# Altium schematic sheet BLE.SchDoc
size 381 x 241 mm
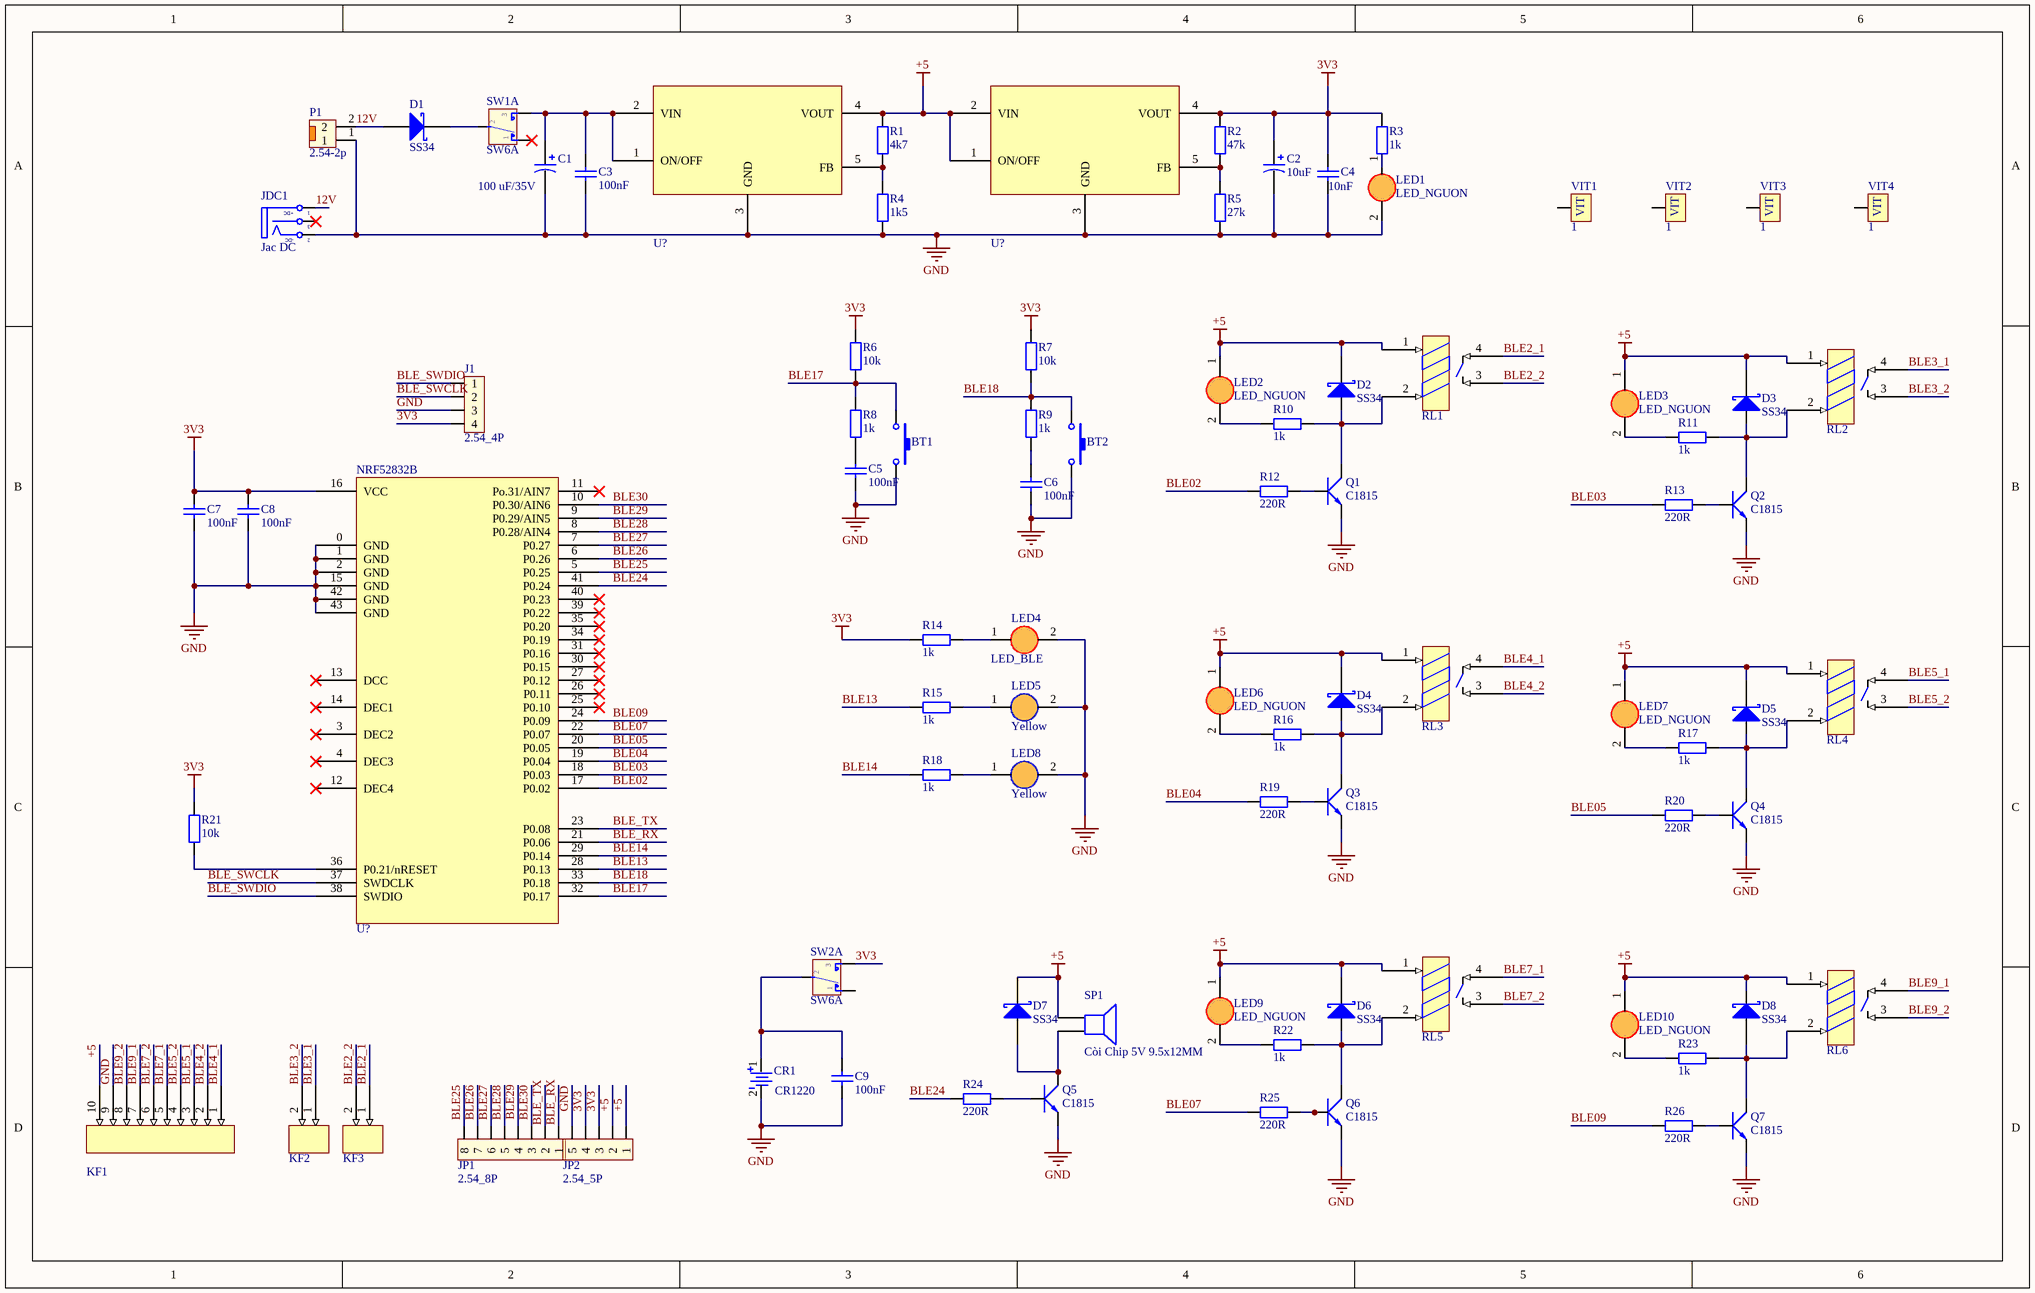
[diagram p0: BLE.SchDoc]

## Parts
BT1  Nút Nhấn 2 Chân 3x6x2.5MM SMD  [Nut Nhan 2 Chan SMD_N]  (value not drawn)
BT2  Nút Nhấn 2 Chân 3x6x2.5MM SMD  [Nut Nhan 2 Chan SMD_N]  (value not drawn)
C1  100 uF/35V  [CAP_ALUM_SMD_100102_TYPE_G]
C2  10uF  [CAP_ALUM_SMD_5054_TYPE_C]
C3  100nF  [tu 0805]
C4  10nF  [tu 0805]
C5  100nF  [tu 0805]
C6  100nF  [tu 0805]
C7  100nF  [tu 0805]
C8  100nF  [tu 0805]
C9  100nF  [tu 0805]
CR1  CR1220  [CR1220_HOLDER_SMD]
D1  SS34  [DIODE_DO214AC_SMA]
D2  SS34  [DIODE_DO214AC_SMA]
D3  SS34  [DIODE_DO214AC_SMA]
D4  SS34  [DIODE_DO214AC_SMA]
D5  SS34  [DIODE_DO214AC_SMA]
D6  SS34  [DIODE_DO214AC_SMA]
D7  SS34  [DIODE_DO214AC_SMA]
D8  SS34  [DIODE_DO214AC_SMA]
J1  2.54_4P  [jump don duc thang 2.54_4p]
JDC1  Jac DC  [DC-IN]
JP1  2.54_8P  [Jump Don Duc Thang 2.54_8p]
JP2  2.54_5P  [jump don duc 2.54_5p]
KF1  KF142R-10  [KF10]  (value not drawn)
KF2  (no value)  [KF2]
KF3  (no value)  [KF2]
LED1  LED_NGUON  [led 0805]
LED2  LED_NGUON  [led 0805]
LED3  LED_NGUON  [led 0805]
LED4  LED_BLE  [led 0805]
LED5  Yellow  [led 0805]
LED6  LED_NGUON  [led 0805]
LED7  LED_NGUON  [led 0805]
LED8  Yellow  [led 0805]
LED9  LED_NGUON  [led 0805]
LED10  LED_NGUON  [led 0805]
MIC1  U?  [Mic5V]
MIC2  U?  [Mic5V]
NRF52832  U?  [NRF52832]  (part B of 2)
P1  2.54-2p  [Header Duc Thang 2P 2.54]
Q1  C1815  [SOT23B]
Q2  C1815  [SOT23B]
Q3  C1815  [SOT23B]
Q4  C1815  [SOT23B]
Q5  C1815  [SOT23B]
Q6  C1815  [SOT23B]
Q7  C1815  [SOT23B]
R1  4k7  [tro 0805]
R2  47k  [tro 0805]
R3  1k  [tro 0805]
R4  1k5  [tro 0805]
R5  27k  [tro 0805]
R6  10k  [tro 0805]
R7  10k  [tro 0805]
R8  1k  [tro 0805]
R9  1k  [tro 0805]
R10  1k  [tro 0805]
R11  1k  [tro 0805]
R12  220R  [tro 0805]
R13  220R  [tro 0805]
R14  1k  [tro 0805]
R15  1k  [tro 0805]
R16  1k  [tro 0805]
R17  1k  [tro 0805]
R18  1k  [tro 0805]
R19  220R  [tro 0805]
R20  220R  [tro 0805]
R21  10k  [tro 0805]
R22  1k  [tro 0805]
R23  1k  [tro 0805]
R24  220R  [tro 0805]
R25  220R  [tro 0805]
R26  220R  [tro 0805]
RL1  Relay-4  [Relay-4]  (value not drawn)
RL2  Relay-4  [Relay-4]  (value not drawn)
RL3  Relay-4  [Relay-4]  (value not drawn)
RL4  Relay-4  [Relay-4]  (value not drawn)
RL5  Relay-4  [Relay-4]  (value not drawn)
RL6  Relay-4  [Relay-4]  (value not drawn)
SP1  Còi Chip 5V 9.5x12MM  [SPEAKER]
SW1  SW6A  [SW6]  (part A of 2)
SW2  SW6A  [SW6]  (part A of 2)
VIT1  1  [VIT]
VIT2  1  [VIT]
VIT3  1  [VIT]
VIT4  1  [VIT]

## Nets
3V3: C2.1 C4.1 C7.1 C8.1 J1.4 JP2.3 JP2.4 MIC2.4(VOUT) NRF52832.16(VCC) R2.1 R3.2 R6.1 R7.1 R14.2 R21.1 SW2.3
+5: D2.2(K) D3.2(K) D4.2(K) D5.2(K) D6.2(K) D7.2(K) D8.2(K) JP2.1 JP2.2 KF1.10 LED2.1(A) LED3.1(A) LED6.1(A) LED7.1(A) LED9.1(A) LED10.1(A) MIC1.4(VOUT) MIC2.1(ON/OFF) MIC2.2(VIN) R1.1 RL1.1 RL2.1 RL3.1 RL4.1 RL5.1 RL6.1 SP1.1
GND: BT1.2 BT2.2 C1.2 C2.2 C3.2 C4.2 C5.2 C6.2 C7.2 C8.2 C9.2 CR1.2(-) J1.3 JDC1.2(TN) JP2.5 KF1.9 LED1.2(K) LED4.2(K) LED5.2(K) LED8.2(K) MIC1.3(GND) MIC2.3(GND) NRF52832.0(GND) NRF52832.1(GND) NRF52832.2(GND) NRF52832.15(GND) NRF52832.42(GND) NRF52832.43(GND) P1.1 Q1.1(E) Q2.1(E) Q3.1(E) Q4.1(E) Q5.1(E) Q6.1(E) Q7.1(E) R4.2 R5.2
12V: D1.1(A) JDC1.1(T) P1.2
BLE02: NRF52832.17(P0.02) R12.2
BLE2_1: KF3.1 RL1.4
BLE2_2: KF3.2 RL1.3
BLE03: NRF52832.18(P0.03) R13.2
BLE3_1: KF2.1 RL2.4
BLE3_2: KF2.2 RL2.3
BLE04: NRF52832.19(P0.04) R19.2
BLE4_1: KF1.1 RL3.4
BLE4_2: KF1.2 RL3.3
BLE05: NRF52832.20(P0.05) R20.2
BLE5_1: KF1.3 RL4.4
BLE5_2: KF1.4 RL4.3
BLE07: NRF52832.22(P0.07) R25.2
BLE7_1: KF1.5 RL5.4
BLE7_2: KF1.6 RL5.3
BLE09: NRF52832.24(P0.09) R26.2
BLE9_1: KF1.7 RL6.4
BLE9_2: KF1.8 RL6.3
BLE13: NRF52832.28(P0.13) R15.2
BLE14: NRF52832.29(P0.14) R18.2
BLE17: BT1.1 NRF52832.32(P0.17) R6.2 R8.2
BLE18: BT2.1 NRF52832.33(P0.18) R7.2 R9.2
BLE24: NRF52832.41(P0.24) R24.2
BLE25: JP1.8 NRF52832.5(P0.25)
BLE26: JP1.7 NRF52832.6(P0.26)
BLE27: JP1.6 NRF52832.7(P0.27)
BLE28: JP1.5 NRF52832.8(P0.28/AIN4)
BLE29: JP1.4 NRF52832.9(P0.29/AIN5)
BLE30: JP1.3 NRF52832.10(P0.30/AIN6)
BLE_RX: JP1.1 NRF52832.21(P0.06)
BLE_SWCLK: J1.2 NRF52832.37(SWDCLK)
BLE_SWDIO: J1.1 NRF52832.38(SWDIO)
BLE_TX: JP1.2 NRF52832.23(P0.08)
NetC1_1: C1.1 C3.1 MIC1.1(ON/OFF) MIC1.2(VIN) SW1.3
NetC5_1: C5.1 R8.1
NetC6_1: C6.1 R9.1
NetC9_1: C9.1 CR1.1(+) SW2.2
NetD1_2: D1.2(K) SW1.2
NetD2_1: D2.1(A) Q1.2(C) R10.1 RL1.2
NetD3_1: D3.1(A) Q2.2(C) R11.1 RL2.2
NetD4_1: D4.1(A) Q3.2(C) R16.1 RL3.2
NetD5_1: D5.1(A) Q4.2(C) R17.1 RL4.2
NetD6_1: D6.1(A) Q6.2(C) R22.1 RL5.2
NetD7_1: D7.1(A) Q5.2(C) SP1.2
NetD8_1: D8.1(A) Q7.2(C) R23.1 RL6.2
NetLED1_1: LED1.1(A) R3.1
NetLED2_2: LED2.2(K) R10.2
NetLED3_2: LED3.2(K) R11.2
NetLED4_1: LED4.1(A) R14.1
NetLED5_1: LED5.1(A) R15.1
NetLED6_2: LED6.2(K) R16.2
NetLED7_2: LED7.2(K) R17.2
NetLED8_1: LED8.1(A) R18.1
NetLED9_2: LED9.2(K) R22.2
NetLED10_2: LED10.2(K) R23.2
NetMIC1_5: MIC1.5(FB) R1.2 R4.1
NetMIC2_5: MIC2.5(FB) R2.2 R5.1
NetNRF52832_36: NRF52832.36(P0.21/nRESET) R21.2
NetQ1_3: Q1.3(B) R12.1
NetQ2_3: Q2.3(B) R13.1
NetQ3_3: Q3.3(B) R19.1
NetQ4_3: Q4.3(B) R20.1
NetQ5_3: Q5.3(B) R24.1
NetQ6_3: Q6.3(B) R25.1
NetQ7_3: Q7.3(B) R26.1

Not connected (* = marked no-connect by the designer): JDC1 3(S)*; NRF52832 3(DEC2)* 4(DEC3)* 11(Po.31/AIN7)* 12(DEC4)* 13(DCC)* 14(DEC1)* 25(P0.10)* 26(P0.11)* 27(P0.12)* 30(P0.15)* 31(P0.16)* 34(P0.19)* 35(P0.20)* 39(P0.22)* 40(P0.23)*; SW1 1*; SW2 1; VIT1 VIT1(1); VIT2 VIT1(1); VIT3 VIT1(1); VIT4 VIT1(1)

## Notes on the sheet
- (in symbol DCIN) +DC; -DC

## Library data of the parts
BT1 BT2 = Nut Nhan 2 Chan SMD: Dán; Don_Vi: Con; So_Chan: 2; Ma_Hang: MH001036; Kieu_Chan: *; Ten_Linh_Kien: Nút Nhấn 2 Chân 3x6x2.5MM SMD; Chung_Loai: Dán
C1 = EEE-FK1C331P: CAP ALUM 330uF 20% 35V SMD; MFR: Panasonic; Value: 330uF/35V; Solder: SMT; MPN: EEE-FK1C331P; Category: CAPACITOR; PinCount: 2
C2 = EEE-FK1C330P: CAP ALUM 33uF 20% 16V SMD; MFR: Panasonic; Value: 33uF/16V; Solder: SMT; MPN: EEE-FK1C330P; Category: CAPACITOR; PinCount: 2
C3-C9 = Tu 0805 6.8nF 50V 10%: Dán; Don_Vi: Con; Ten_Linh_Kien: Tụ 0805 6.8nF 10% 50V; Ma_Hang: MH009987; Chung_Loai: Dán
D1-D8 = SS34: DIODE SCHOTTKY 40V 3A SMA; Solder: SMT; MPN: SS34; Value: SS34; MFR: *
J1 = Jump Don Duc Thang 2.54_4P: Cắm; Don_Vi: Con; Ma_Hang: MH000903; So_Chan: 4; Ten_Linh_Kien: Jump Đơn Đực 2.54MM 1x40P Thẳng 11MM; Kieu Chan: *; Chung_Loai: Cắm
JDC1 = DCIN: Jac DC input; Value: Jac DC
JP1 = Jump Don Duc 2.54_8P: Cắm; Ten_Linh_Kien: Jump Đơn Đực 2.54MM 1x40P Thẳng 11MM; Ma_Hang: MH000903; Don_Vi: Con; Ghi_Chu: *; Kieu Chan: *; Chung_Loai: Cắm
JP2 = Jump Don Duc 2.54_5P: Cắm; Ten_Linh_Kien: Jump Đơn Đực 2.54MM 2x40P Thẳng 11MM; Don_Vi: Con; So_Chan: 5; Ma_Hang: MH000903; Kieu_Chan: *; Chung_Loai: Cắm
KF1 = KF10: KF142R-10P-5.08mm
KF2 KF3 = KF2: KF142R-2 5.08mm
LED1-LED4 LED6 LED7 LED9 LED10 = Led 0805 Do: Dán; Don_Vi: Con; So_Chan: 2; Ten_Linh_Kien: LED 0805 Màu Đỏ; Ma_Hang: MH000897; Chung_Loai: Dán; Kieu_Chan: *
LED5 LED8 = Led 0805 Xanh Duong: Dán; Don_Vi: Con; So_Chan: 2; Ten_Linh_Kien: LED 0805 Màu Xanh Dương (Blue); Ma_Hang: MH002327; Chung_Loai: Dán; Kieu_Chan: *
MIC1 MIC2 = Mic5V: 3A
P1 = Header 2.54-2p Duc Thang: Cắm; So_Chan: 2; Don_Vi: Con; Ten_Linh_Kien: Header 2P XH2.54-2P Đực Thẳng; Ma_Hang: MH001283; Chung_Loai: Cắm; Kieu_Chan: *
Q1-Q7 = C1815: NPN 600mW, ECB; Value: C1815
R1-R26 = Tro 0805 1% 10k: Dán; Don_Vi: Con; So_Chan: 2; Ten_Linh_Kien: Trở 0805 1% 10k; Ma_Hang: MH005473; Chung_Loai: Dán; Kieu_Chan: *
SP1 = Coi Chip 5V: Cắm; Don_Vi: Con; Ma_Hang: MH000902; Ten_Linh_Kien: Còi Chip 5V 9.5x12MM; Ghi_Chu: *; Kieu_Chan: *; Chung_Loai: Cắm
SW1 SW2 = SW6A: SW-DTDP - 6 Pin; Value: SW6
VIT1-VIT4 = VIT: Oc Vit